# Altium schematic sheet USB_Power.SchDoc
size A4
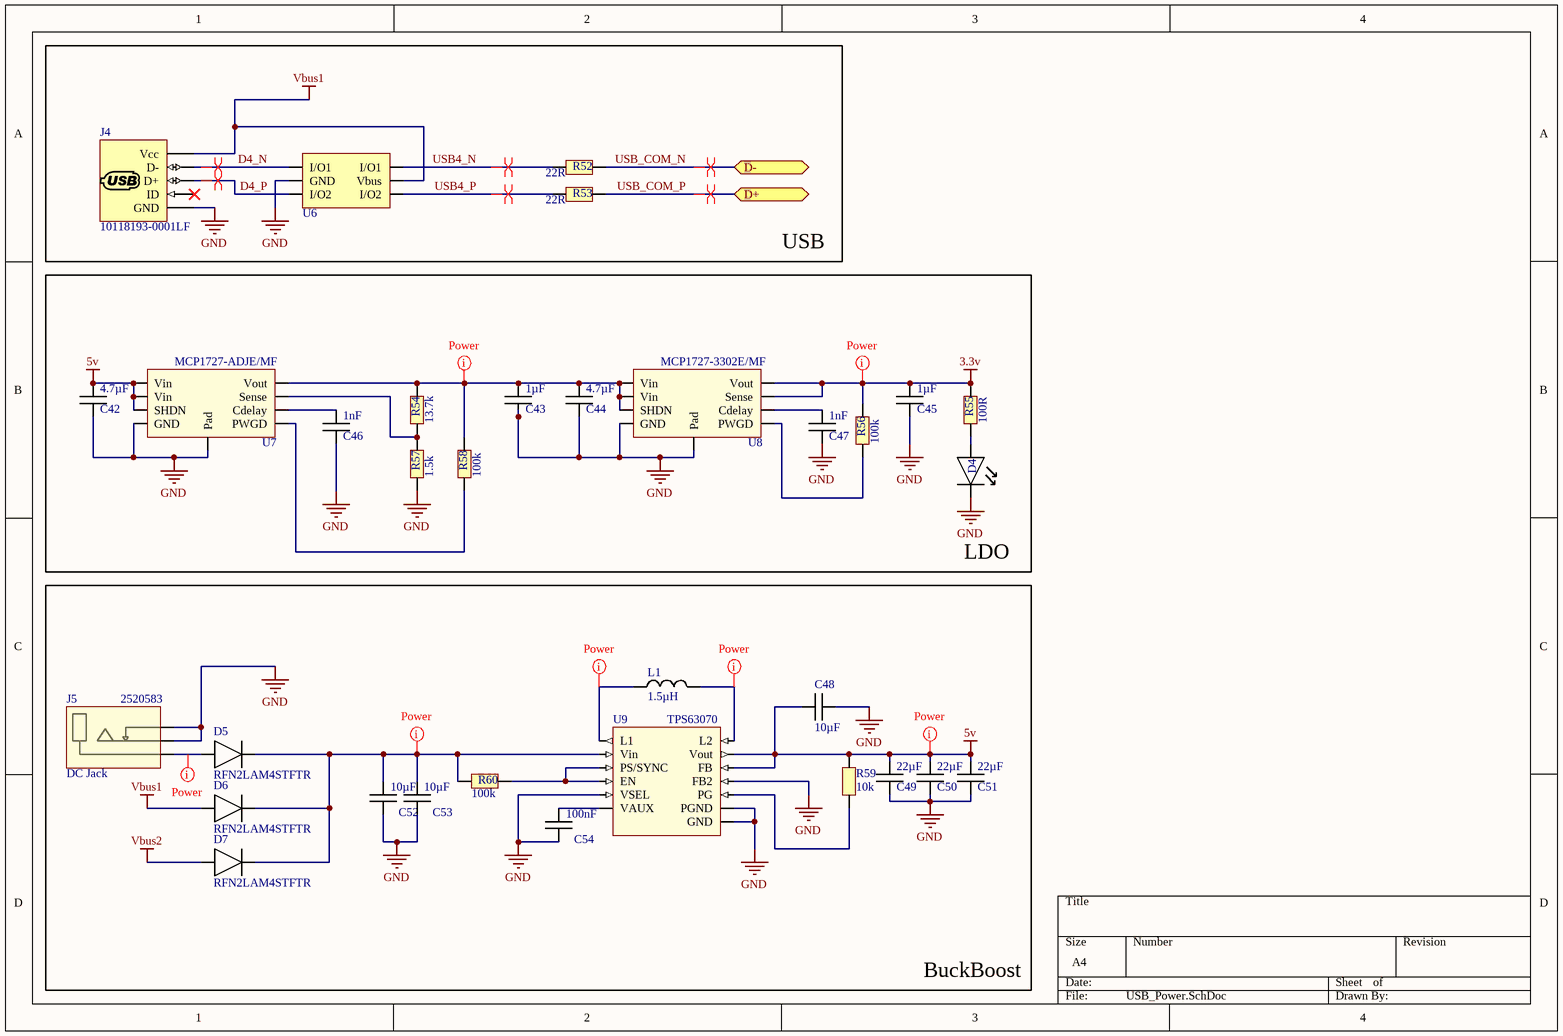
[diagram p0: USB_Power.SchDoc]

## Parts
C42  4.7µF  [0603]
C43  1µF  [0603]
C44  4.7µF  [0603]
C45  1µF  [0603]
C46  1nF  [0603]
C47  1nF  [0603]
C48  10µF  [0603]
C49  22µF  [0603]
C50  22µF  [0603]
C51  22µF  [0603]
C52  10µF  [0603]
C53  10µF  [0603]
C54  100nF  [0603]
D4  Led  [LED_0603]  (value not drawn)
D5  RFN2LAM4STFTR  [LEd_Pilou]
D6  RFN2LAM4STFTR  [LEd_Pilou]
D7  RFN2LAM4STFTR  [LEd_Pilou]
J4  10118193-0001LF  [Mini_USB_mixte]
J5  DC Jack  Supplier Part Number 1: 2520583  [Jack]
L1  1.5µH  [self_alim]
R52  22R  [0603]
R53  22R  [0603]
R54  13.7k  [0603]
R55  100R  [0603]
R56  100k  [0603]
R57  1.5k  [0603]
R58  100k  [0603]
R59  10k  [0603]
R60  100k  [0603]
U6  USBLC6-2P6  [SOT95P280X145-6M]  (value not drawn)
U7  MCP1727-ADJE/MF  [PSON65P300X100_HS-9M]
U8  MCP1727-3302E/MF  [PSON65P300X100_HS-9M]
U9  TPS63070  [BuckBoost]

## Blocks framed on the sheet
USB: J4 R52 R53 U6
LDO: C42-C47 D4 R54-R58 U7 U8
BuckBoost: C48-C54 D5-D7 J5 L1 R59 R60 U9

## Ports
D+ (bidir), D- (bidir)

## Nets
3.3v: C45.2 R55.2 R56.2 U8.7(Sense) U8.8(Vout)
5v: C42.2 C48.2 C49.2 C50.2 C51.2 R59.2 U7.1(Vin) U7.2(Vin) U7.3(SHDN) U9.5(FB) U9.7(Vout)
GND: C42.1 C43.1 C44.1 C45.1 C46.1 C47.1 C48.1 C49.1 C50.1 C51.1 C52.1 C53.1 C54.1 D4.2 J4.5(GND) J5.2(PAD) J5.3(PAD) R57.1 U6.2(GND) U7.4(GND) U7.9(Pad) U8.4(GND) U8.9(Pad) U9.4(GND) U9.6(FB2) U9.10(PGND) U9.15(VSEL)
Vbus1: D6.1 J4.1(Vcc) U6.5(Vbus)
Vbus2: D7.1
D4_N: J4.2(D-) U6.1(I/O1)
D4_P: J4.3(D+) U6.3(I/O2)
USB4_N: R52.1 U6.6(I/O1)
USB4_P: R53.1 U6.4(I/O2)
USB_COM_N: R52.2 ; port D-
USB_COM_P: R53.2 ; port D+
NetC43_2: C43.2 C44.2 R54.2 R58.2 U7.8(Vout) U8.1(Vin) U8.2(Vin) U8.3(SHDN)
NetC46_2: C46.2 U7.6(Cdelay)
NetC47_2: C47.2 U8.6(Cdelay)
NetC52_2: C52.2 C53.2 D5.2 D6.2 D7.2 R60.1 U9.12(Vin)
NetC54_2: C54.2 U9.3(VAUX)
NetD4_1: D4.1 R55.1
NetD5_1: D5.1 J5.1(PAD)
NetL1_1: L1.1 U9.11(L1)
NetL1_2: L1.2 U9.9(L2)
NetR54_1: R54.1 R57.2 U7.7(Sense)
NetR56_1: R56.1 U8.5(PWGD)
NetR58_1: R58.1 U7.5(PWGD)
NetR59_1: R59.1 U9.2(PG)
NetR60_2: R60.2 U9.1(PS/SYNC) U9.14(EN)

Not connected (* = marked no-connect by the designer): J4 4(ID)*

## Layout directives
differential pair; rule Differential Pairs Routing [Pref Gap = 0.25mm    Min Gap  = 0.25mm    Max Gap  = 0.25mmPref Width = 0.17mm    Min Width  = 0.17mm    Max Width  = 0.17mm]; net class USB_diff: D4_N, D4_P, USB4_N, USB4_P, USB_COM_N, USB_COM_P
net class Alim; rule Width Constraint [Pref Width = 1.367mm    Min Width = 0.254mm    Max Width = 1.367mm]: 3.3v, 5v, NetC43_2, NetC52_2, NetD5_1, NetL1_1, NetL1_2

## Library data of the parts
C42-C54 = Capa
D4 = Led: Manufacturer 1: Rohm; Manufacturer Part Number 1: SML-D12P8WT86C; Color: Green; Lens Color: White; Lens Style: Flat; Luminous Intensity: 6.3mcd; Forward Voltage: 2.2V; Test Current: 20mA; Dominant Wavelength: 560nm; Lens Size: 0.8mm; Supplier 1: Farnell; Supplier Part Number 1: 2687486; Stock 1: 22850; Pricing 1: 5=0,23500, 25=0,22800, 100=0,09470, 250=0,08760, 500=0,06920, 1000=0,05080 (EUR); RoHS: No; Mount: Surface Mount; Case/Package: 0603; Case Code (Imperial): 0603; Case Code (Metric): 1608; Packaging: Tape and Reel; Length: 1.6mm; Height: 0.65mm; Width: 0.8mm; ComponentLink1URL: http://www.farnell.com/datasheets/2186940.pdf?src-supplier=Farnell; ComponentLink1Description: http://www.farnell.com/datasheets/2186940.pdf?src-supplier=Farnell; ComponentLink2URL: https://www.rohm.com/datasheet/SML-D12P8W(C)/sml-d12x8(c)-e?src-supplier=Digi-Key; ComponentLink2Description: https://www.rohm.com/datasheet/SML-D12P8W(C)/sml-d12x8(c)-e?src-supplier=Digi-Key; ComponentLink3URL: http://www.farnell.com/datasheets/2186940.pdf?src-supplier=Newark; ComponentLink3Description: http://www.farnell.com/datasheets/2186940.pdf?src-supplier=Newark; ComponentLink4URL: http://www.farnell.com/datasheets/2186940.pdf?src-supplier=Element14; ComponentLink4Description: http://www.farnell.com/datasheets/2186940.pdf?src-supplier=Element14
D5-D7 = RFN2LAM4STFTR: RFN2LAM4STF IS THE HIGH RELIABIL; Manufacturer 1: Rohm; Max Reverse Voltage (DC): 400V; Average Rectified Current: 1.5A; Reverse Recovery Time: 30ns; Supplier 1: Mouser; Manufacturer Part Number 1: RFN2LAM4STFTR; Stock 1: 3480; Pricing 1: 1=0,46000, 10=0,37700, 100=0,23000, 1000=0,17800, 3000=0,15200, 9000=0,14100, 24000=0,13400, 45000=0,13100, 99000=0,12600 (USD); RoHS: No; Mount: Surface Mount; Packaging: Tape and Reel; ComponentLink1URL: https://www.rohm.com/datasheet/RFN2LAM4STF/rfn2lam4stf-e?src-supplier=Digi-Key; ComponentLink1Description: https://www.rohm.com/datasheet/RFN2LAM4STF/rfn2lam4stf-e?src-supplier=Digi-Key; Supplier Part Number 1: 755-RFN2LAM4STFTR
J4 = 10118193-0001LF: CONN RCPT USB2.0 MICRO B SMD R/A; Manufacturer 1: Amphenol FCI; Gender: Female; Connector Type: USB,Receptacle; Number of Contacts: 5; Insulation Resistance: 1GR; Number of Ports: 1; Current Rating: 1.8A; Max Voltage Rating (AC): 100V; Pitch: 0.65mm; Supplier 1: Digi-Key; Manufacturer Part Number 1: 10118193-0001LF; Stock 1: 117828; Pricing 1: 1=0,43000, 10=0,40500, 25=0,36440, 50=0,32400, 100=0,31040, 250=0,28344, 500=0,26994 (USD); RoHS: Yes; Mount: Surface Mount,Horizontal; Contact Material: Copper Alloy; Contact Plating: Gold; Color: Black; Number of Terminals: 5; Housing Material: Polymer; Min Operating Temperature: -55°C; Max Operating Temperature: 85°C; Termination: Solder; Orientation: Right Angle; Package Quantity: 1200; Packaging: Tape and Reel; Voltage Rating: 100V; Features: Shielded; Length: 7.86mm; Depth: 5.67mm; Radiation Hardening: No; Flammability Rating: UL94 V-0; ComponentLink1URL: https://datasheet.ciiva.com/851/10118193-851106.pdf?src-supplier=Digi-Key; ComponentLink1Description: https://datasheet.ciiva.com/851/10118193-851106.pdf?src-supplier=Digi-Key; ComponentLink2URL: https://datasheet.ciiva.com/14802/10118193-0001lf-webpage-14802386.pdf?src-supplier=Arrow; ComponentLink2Description: https://datasheet.ciiva.com/14802/10118193-0001lf-webpage-14802386.pdf?src-supplier=Arrow; ComponentLink3URL: https://datasheet.ciiva.com/26853/getdatasheetpartid-418618-26853893.pdf?src-supplier=Verical; ComponentLink3Description: https://datasheet.ciiva.com/26853/getdatasheetpartid-418618-26853893.pdf?src-supplier=Verical; ComponentLink4URL: https://datasheet.ciiva.com/4598/10118193ac-197151-4598799.pdf?src-supplier=Mouser; ComponentLink4Description: https://datasheet.ciiva.com/4598/10118193ac-197151-4598799.pdf?src-supplier=Mouser; ComponentLink5URL: https://datasheet.ciiva.com/851/10118193-851107.pdf?src-supplier=Digi-Key; ComponentLink5Description: https://datasheet.ciiva.com/851/10118193-851107.pdf?src-supplier=Digi-Key; ComponentLink6URL: https://datasheet.ciiva.com/851/10118193-851108.pdf?src-supplier=Digi-Key; ComponentLink6Description: https://datasheet.ciiva.com/851/10118193-851108.pdf?src-supplier=Digi-Key; ComponentLink7URL: https://datasheet.ciiva.com/14618/70236827-14618887.pdf?src-supplier=Allied+Electronics; ComponentLink7Description: https://datasheet.ciiva.com/14618/70236827-14618887.pdf?src-supplier=Allied+Electronics; Supplier Part Number 1: 609-4616-1-ND
J5 = Jack: Manufacturer 1: Cliff; Manufacturer Part Number 1: FC681465S; Current Rating: 2A; Voltage Rating: 12V; Gender: Male; Supplier 1: Farnell; Stock 1: 116; Pricing 1: 1=2,21000, 50=0,98100, 100=0,90100, 250=0,80300, 500=0,76100, 1000=0,73600 (EUR); RoHS: No; Termination: SMD/SMT; Voltage Rating (DC): 12V; REACH SVHC: No SVHC; ComponentLink1URL: http://www.farnell.com/datasheets/2005854.pdf?src-supplier=Farnell; ComponentLink1Description: http://www.farnell.com/datasheets/2005854.pdf?src-supplier=Farnell; ComponentLink2URL: http://www.farnell.com/datasheets/2005854.pdf?src-supplier=Element14; ComponentLink2Description: http://www.farnell.com/datasheets/2005854.pdf?src-supplier=Element14
L1 = self_alim: Manufacturer 1: Coilcraft; Manufacturer Part Number 1: XFL4020-152MEB; Core Material: Composite; Self Resonant Frequency: 59MHz; Shielding: Shielded; Tolerance: 20%; Inductance: 1.5uH; Max DC Current: 9.1A; DC Resistance (DCR): 15.8mR; Test Frequency: 100kHz; Supplier 1: Mouser; Stock 1: 10924; Pricing 1: 1=2,13000, 10=2,13000, 50=1,85000, 100=1,55000, 200=1,55000, 500=0,96000, 1000=0,88400, 2000=0,82300 (USD); RoHS: Yes; Min Operating Temperature: -40°C; Max Operating Temperature: 125°C; Packaging: Tape and Reel; Package Quantity: 25; Termination: SMD/SMT; Length: 4.3mm; Height: 2.1mm; Width: 4.3mm; Lead Free: Contains Lead; ComponentLink1URL: http://www.mouser.com/ds/2/597/xfl4020-270756.pdf?src-supplier=Mouser; ComponentLink1Description: http://www.mouser.com/ds/2/597/xfl4020-270756.pdf?src-supplier=Mouser; Supplier Part Number 1: 994-XFL4020-152MEB
R52-R60 = Resistance
U6 = USBLC6-2P6: TVS DIODE 5.25V 17V SOT666; Manufacturer 1: STMicroelectronics; Direction: Unidirectional,Bidirectional; Operating Supply Voltage: 5V; Number of Elements: 1; Capacitance: 3.5pF; Reverse Breakdown Voltage: 6V; Number of Channels: 2; Power Line Protection: Yes; Test Current: 1mA; Max Reverse Leakage Current: 150nA; Peak Pulse Current: 5A; Element Configuration: Dual; Supplier 1: Farnell; Manufacturer Part Number 1: USBLC6-2P6; Stock 1: 22255; Pricing 1: 5=0,45800, 50=0,40500, 100=0,24700, 500=0,19100, 1500=0,17700 (EUR); RoHS: Yes; Mount: Surface Mount; Case/Package: SOT-666; Number of Pins: 6; Contact Plating: Tin,Matte; Min Operating Temperature: -40°C; Max Operating Temperature: 125°C; Package Quantity: 1; Packaging: Tape and Reel; Number of Bidirectional Channels: 2; Reverse Standoff Voltage: 5V; Min Breakdown Voltage: 6V; Clamping Voltage: 17V; Polarity: Unidirectional,Bidirectional; Breakdown Voltage: 6V; Termination: SMD/SMT; Working Voltage: 5V; ESD Protection: Yes; Leakage Current: 150nA; Max Breakdown Voltage: 6V; Length: 1.7mm; Height: 0.6mm; Width: 1.3mm; Depth: 1.3mm; Radiation Hardening: No; REACH SVHC: No SVHC; Lead Free: Lead Free; ComponentLink1URL: https://datasheet.ciiva.com/15143/getdatasheetpartid-98673-15143462.pdf?src-supplier=Verical; ComponentLink1Description: https://datasheet.ciiva.com/15143/getdatasheetpartid-98673-15143462.pdf?src-supplier=Verical; ComponentLink2URL: https://datasheet.ciiva.com/14186/usblc6-2-st-eng-tds-14186568.pdf?src-supplier=Distrelec; ComponentLink2Description: https://datasheet.ciiva.com/14186/usblc6-2-st-eng-tds-14186568.pdf?src-supplier=Distrelec; ComponentLink3URL: https://datasheet.ciiva.com/22692/1690354-22692453.pdf?src-supplier=Element14; ComponentLink3Description: https://datasheet.ciiva.com/22692/1690354-22692453.pdf?src-supplier=Element14; ComponentLink4URL: https://datasheet.ciiva.com/22685/1690354-22685832.pdf?src-supplier=Element14; ComponentLink4Description: https://datasheet.ciiva.com/22685/1690354-22685832.pdf?src-supplier=Element14; ComponentLink5URL: https://datasheet.ciiva.com/16378/cd00050750-16378714.pdf?src-supplier=Future+Electronics; ComponentLink5Description: https://datasheet.ciiva.com/16378/cd00050750-16378714.pdf?src-supplier=Future+Electronics; ComponentLink6URL: https://datasheet.ciiva.com/4508/cd00050750-4508892.pdf?src-supplier=Mouser; ComponentLink6Description: https://datasheet.ciiva.com/4508/cd00050750-4508892.pdf?src-supplier=Mouser; ComponentLink7URL: https://datasheet.ciiva.com/41444/001184108-da-01-en-ic-esd-protection-usblc6-2p6-sot-666-stm-41444134.pdf?src-supplier=Conrad; ComponentLink7Description: https://datasheet.ciiva.com/41444/001184108-da-01-en-ic-esd-protection-usblc6-2p6-sot-666-stm-41444134.pdf?src-supplier=Conrad; Supplier Part Number 1: 1295310
U7 = LDO: Manufacturer 1: Microchip; Number of Outputs: 1; Min Input Voltage: 2.3V; Max Input Voltage: 6V; Output Voltage: 5V; Dropout Voltage: 330mV; Output Current: 1.5A; Input Bias Current: 120uA; Reference Voltage: 410mV; Min Output Voltage: 800mV; Polarity: Positive; Quiescent Current: 220uA; Accuracy: 0.5%; Output Type: Adjustable; Supplier 1: Farnell; Supplier Part Number 1: 1851979; Manufacturer Part Number 1: MCP1727-ADJE/MF; Stock 1: 1071; Pricing 1: 1=0,75600, 10=0,74900, 25=0,63900, 100=0,57400 (EUR); RoHS: Yes; Mount: Surface Mount; Case/Package: DFN; Number of Pins: 8; Min Operating Temperature: -40°C; Max Operating Temperature: 125°C; Packaging: Rail/Tube; Max Output Current: 1.5A; Package Quantity: 120; Max Output Voltage: 5V; Output Voltage Accuracy: 0.5%; Length: 3mm; Height: 0.95mm; Width: 3mm; Radiation Hardening: No; REACH SVHC: No SVHC; Lead Free: Lead Free; ComponentLink1URL: https://datasheet.ciiva.com/41458/001085927-da-01-en-ic-reg-ldo-adj-mcp1727-adje-mf-dfn-8-mcp-41458863.pdf?src-supplier=Conrad; ComponentLink1Description: https://datasheet.ciiva.com/41458/001085927-da-01-en-ic-reg-ldo-adj-mcp1727-adje-mf-dfn-8-mcp-41458863.pdf?src-supplier=Conrad; ComponentLink2URL: https://datasheet.ciiva.com/8239/jp027822-8239381.pdf?src-supplier=Avnet; ComponentLink2Description: https://datasheet.ciiva.com/8239/jp027822-8239381.pdf?src-supplier=Avnet; ComponentLink3URL: https://datasheet.ciiva.com/16592/jp027822-16592597.pdf?src-supplier=Avnet+Europe; ComponentLink3Description: https://datasheet.ciiva.com/16592/jp027822-16592597.pdf?src-supplier=Avnet+Europe; ComponentLink4URL: https://datasheet.ciiva.com/2041/21999b-2041127.pdf?src-supplier=Digi-Key; ComponentLink4Description: https://datasheet.ciiva.com/2041/21999b-2041127.pdf?src-supplier=Digi-Key; ComponentLink5URL: https://datasheet.ciiva.com/8041/490994-8041415.pdf?src-supplier=Element14; ComponentLink5Description: https://datasheet.ciiva.com/8041/490994-8041415.pdf?src-supplier=Element14
U8 = LDO: Manufacturer 1: Microchip; Output Current: 1.5A; Output Voltage: 3.3V; Dropout Voltage: 330mV; Max Input Voltage: 6V; Min Input Voltage: 2.3V; Number of Outputs: 1; Input Bias Current: 120uA; Polarity: Positive; Quiescent Current: 220uA; Accuracy: 2%; Output Type: Fixed; Supplier 1: Farnell; Supplier Part Number 1: 1851978; Manufacturer Part Number 1: MCP1727-3302E/MF; Stock 1: 1015; Pricing 1: 1=0,75600, 10=0,74900, 25=0,63900, 100=0,57400 (EUR); RoHS: Yes; Mount: Surface Mount; Case/Package: DFN; Number of Pins: 8; Min Operating Temperature: -40°C; Max Operating Temperature: 125°C; Package Quantity: 120; Packaging: Rail/Tube; Max Output Current: 1.5A; Min Output Voltage: 3.3V; Output Voltage Accuracy: 2%; Length: 3mm; Height: 0.95mm; Width: 3mm; Radiation Hardening: No; REACH SVHC: No SVHC; Lead Free: Lead Free; ComponentLink1URL: https://datasheet.ciiva.com/41458/001085925-da-01-en-ic-reg-ldo-3-mcp1727-3302e-mf-dfn-8-mcp-41458860.pdf?src-supplier=Conrad; ComponentLink1Description: https://datasheet.ciiva.com/41458/001085925-da-01-en-ic-reg-ldo-3-mcp1727-3302e-mf-dfn-8-mcp-41458860.pdf?src-supplier=Conrad; ComponentLink2URL: https://datasheet.ciiva.com/2057/21999b-2057399.pdf?src-supplier=Digi-Key; ComponentLink2Description: https://datasheet.ciiva.com/2057/21999b-2057399.pdf?src-supplier=Digi-Key; ComponentLink3URL: https://datasheet.ciiva.com/15200/getdatasheetpartid-453602-15200278.pdf?src-supplier=Verical; ComponentLink3Description: https://datasheet.ciiva.com/15200/getdatasheetpartid-453602-15200278.pdf?src-supplier=Verical
U9 = 12-5V_BuckBoost: Manufacturer 1: Texas Instruments; Manufacturer Part Number 1: TPS630701RNMR; Quiescent Current: 50uA; Supplier 1: Mouser; Stock 1: 3900; Pricing 1: 1=2,59000, 10=2,20000, 100=1,76000, 500=1,54000, 1000=1,28000, 3000=1,19000, 6000=1,15000, 9000=1,10000 (USD); RoHS: No; Lead Free: Lead Free; ComponentLink1URL: http://www.ti.com/lit/ds/symlink/tps63070.pdf?src-supplier=Digi-Key; ComponentLink1Description: http://www.ti.com/lit/ds/symlink/tps63070.pdf?src-supplier=Digi-Key; Supplier Part Number 1: 595-TPS630701RNMR